# EAGLE schematic riffle-ctdl-v0.1 (EAGLE 7.2.0)
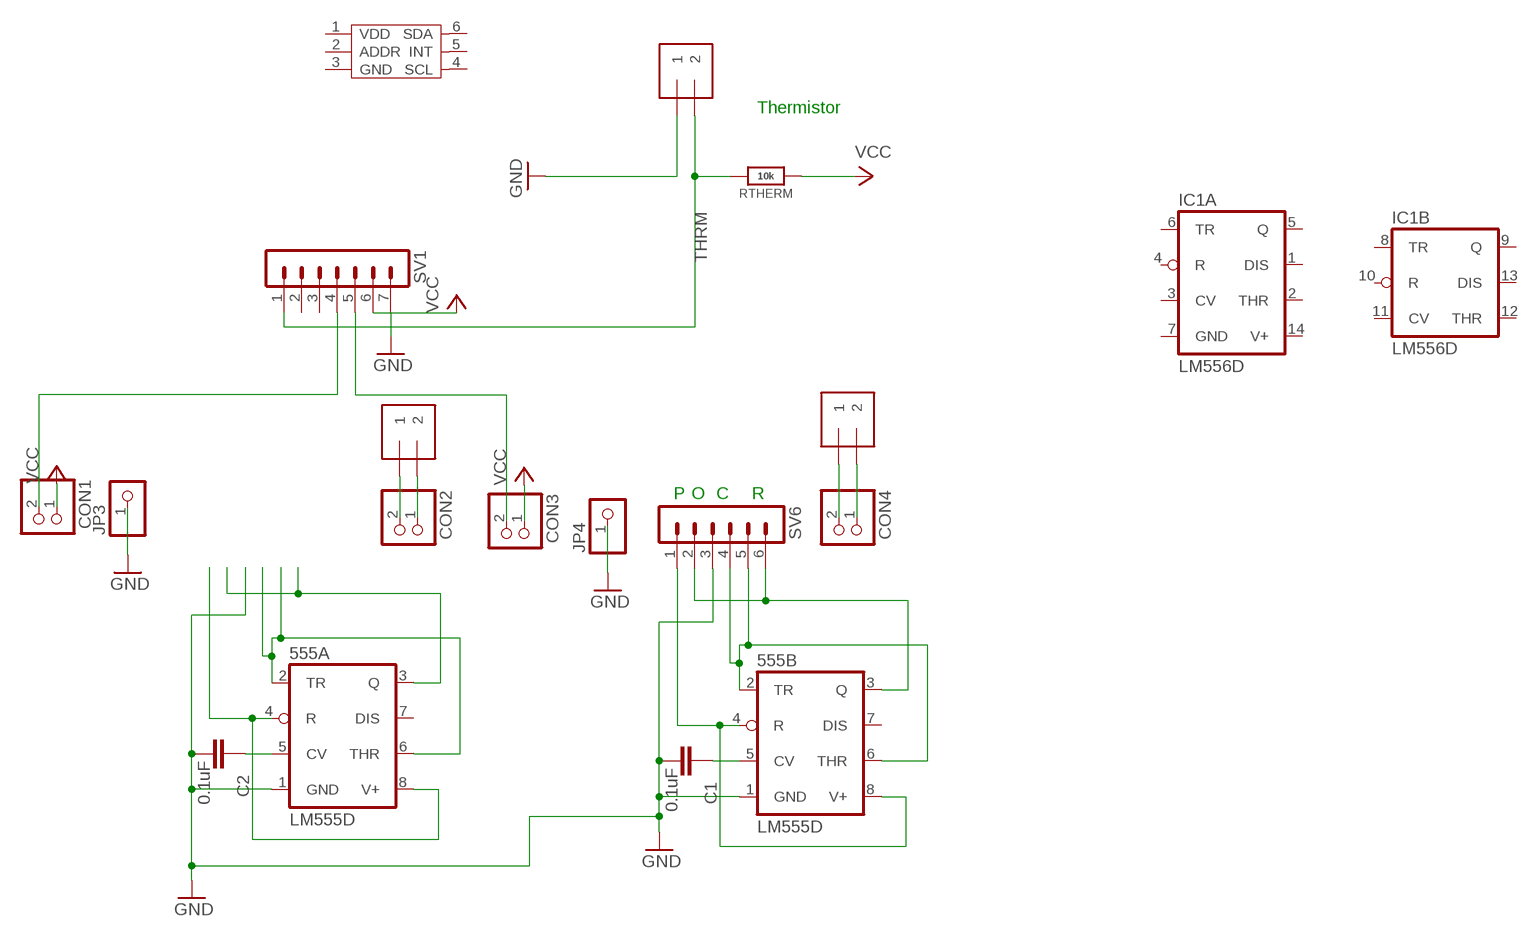
[diagram p0: schematic, sheet 1]

## Parts
555A  LM555D  [SO08]
555B  LM555D  [SO08]
C1  0.1uF  CAP0603-CAP  [0603-CAP]
C2  0.1uF  CAP0603-CAP  [0603-CAP]
CON1  PINHD-1X2  [1X02]
CON2  PINHD-1X2  [1X02]
CON3  PINHD-1X2  [1X02]
CON4  PINHD-1X2  [1X02]
IC1  LM556D  [SO14]
IN1  1X2-3.5MM  [1X2-3.5MM]
IN2  1X2-3.5MM  [1X2-3.5MM]
JP3  PINHD-1X1  [1X01]
JP4  PINHD-1X1  [1X01]
RTHERM  10k  RESISTOR_0603_NOOUT  [0603-NO]
SV1  MA07-1  [MA07-1]
SV6  MA06-1  [MA06-1]
THRM  1X2-3.5MM  [1X2-3.5MM]
U1  TSL2561T  [TMB-6]

## Nets
AOUT: 555A.3(Q)
AOUT1: 555B.3(Q) SV6.2 SV6.6
GND: 555A.1(GND) 555B.1(GND) C1.1 C2.1 JP3.1 JP4.1 SV1.7 SV6.3 THRM.1
N$1: 555B.2(TR) 555B.6(THR) SV6.4 SV6.5
N$2: 555B.5(CV) C1.2
N$10: CON2.2 IN1.1
N$11: 555A.2(TR) 555A.6(THR)
N$14: 555A.5(CV) C2.2
N$15: CON2.1 IN1.2
N$16: CON4.2 IN2.1
N$17: CON4.1 IN2.2
N$18: CON1.2 SV1.4
N$19: CON3.2 SV1.5
THRM: RTHERM.2 SV1.1 THRM.2
VAIN: 555A.4(R) 555A.8(V+)
VAIN1: 555B.4(R) 555B.8(V+) SV6.1
VCC: CON1.1 CON3.1 RTHERM.1 SV1.6
Unconnected: 555A.7(DIS) 555B.7(DIS) IC1.1(A:DIS) IC1.2(A:THR) IC1.3(A:CV) IC1.4(A:R) IC1.5(A:Q) IC1.6(A:TR) IC1.8(B:TR) IC1.9(B:Q) IC1.10(B:R) IC1.11(B:CV) IC1.12(B:THR) IC1.13(B:DIS) SV1.2 SV1.3 U1.1(VDD) U1.2(ADDR) U1.3(GND) U1.4(SCL) U1.5(INT) U1.6(SDA)

## Notes on the sheet
- Thermistor
- P | O | C | R

## Power pins joined to a net without a drawn wire
GND: IC1.7(A:GND)
V+: IC1.14(A:V+)

## Library data of the parts
555A 555B = adafruit:*555: TIMER Changed DIP package to have round (not oval) pin pads http://www.ladyada.net/library/pcb/eaglelibrary.html
C1 C2 = SparkFun:CAP: Capacitor Standard 0603 ceramic capacitor, and 0.1" leaded capacitor.
CON1-CON4 = pinhead:PINHD-1X2: PIN HEADER
IC1 = linear:*556: Dual TIMER
IN1 IN2 THRM = adafruit:1X2: 3.5mm Terminal block http://www.ladyada.net/library/pcb/eaglelibrary.html
JP3 JP4 = pinhead:PINHD-1X1: PIN HEADER
RTHERM = microbuilder:RESISTOR: Resistors For new designs, use the packages preceded by an '_' character since they are more reliable: The following footprints should be used on most boards: _0402 - Standard footprint for regular board layouts _0603 - Standard footprint for regular board layouts _0805 - Standard footprint for regular board layouts _1206 - Standard footprint for regular board layouts For extremely tight-pitch boards where space is at a premium, the following 'micro-pitch' footprints can be used (smaller pads, no silkscreen outline, etc.): _0402MP - Micro-pitch footprint for very dense/compact boards _0603MP - Micro-pitch footprint for very dense/compact boards _0805MP - Micro-pitch footprint for very dense/compact boards _1206MP - Micro-pitch footprint for very dense/compact boards
SV1 = con-lstb:MA07-1: PIN HEADER; OC_FARNELL: unknown; OC_NEWARK: unknown
SV6 = con-lstb:MA06-1: PIN HEADER; OC_FARNELL: unknown; OC_NEWARK: unknown
U1 = TSL2561:TSL2561